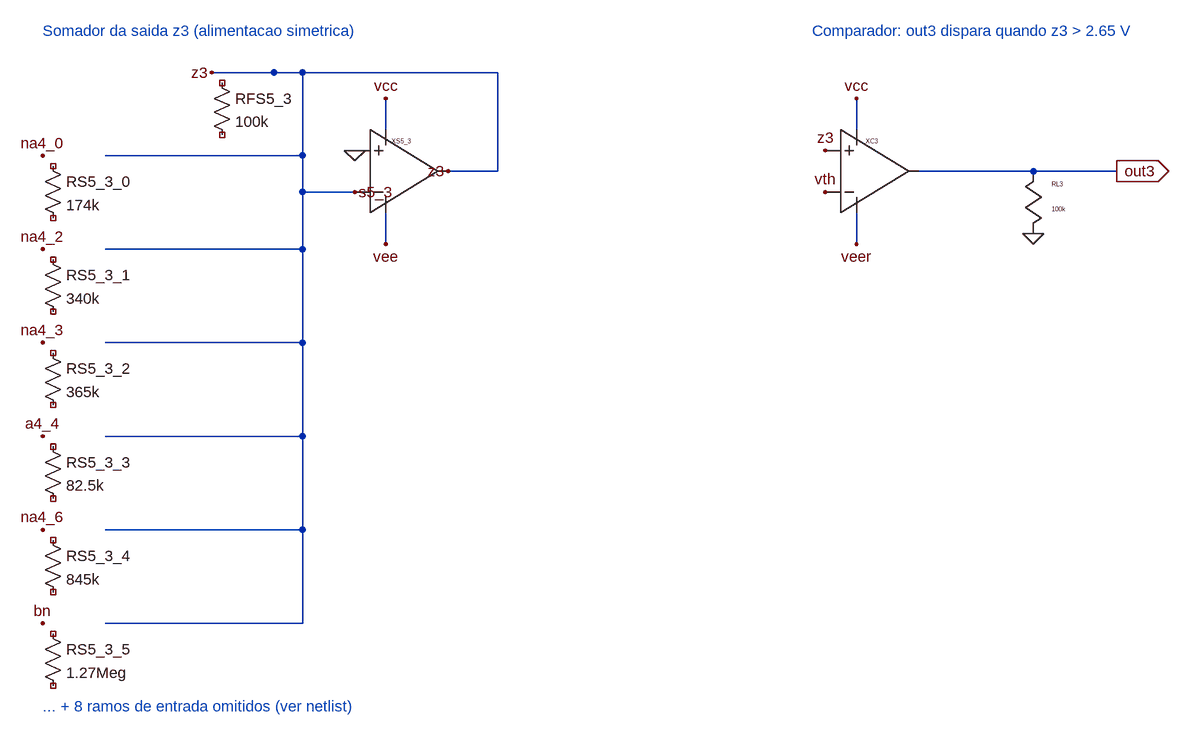
[diagram p0: schematic neuronio_saida.asc]
neuronio_saida.asc, the LTspice schematic file:
Version 4
SHEET 1 1976 1237
WIRE 624 184 624 136
WIRE 624 312 624 360
WIRE 452 96 496 96
WIRE 720 248 796 248
WIRE 796 248 796 96
WIRE 796 96 356 96
WIRE 192 224 496 224
WIRE 192 368 496 368
WIRE 192 512 496 512
WIRE 192 656 496 656
WIRE 192 800 496 800
WIRE 192 944 496 944
WIRE 496 96 496 944
WIRE 496 280 576 280
WIRE 1348 184 1348 136
WIRE 1348 312 1348 360
WIRE 1444 248 1620 248
WIRE 1620 248 1748 248
SYMBOL opamp2 576 184 R0
SYMATTR InstName XS5_3
SYMATTR Value CLAW_IDEAL_OPAMP
SYMBOL res 356 96 R0
SYMATTR InstName RFS5_3
SYMATTR Value 100k
SYMBOL res 96 224 R0
SYMATTR InstName RS5_3_0
SYMATTR Value 174k
SYMBOL res 96 368 R0
SYMATTR InstName RS5_3_1
SYMATTR Value 340k
SYMBOL res 96 512 R0
SYMATTR InstName RS5_3_2
SYMATTR Value 365k
SYMBOL res 96 656 R0
SYMATTR InstName RS5_3_3
SYMATTR Value 82.5k
SYMBOL res 96 800 R0
SYMATTR InstName RS5_3_4
SYMATTR Value 845k
SYMBOL res 96 944 R0
SYMATTR InstName RS5_3_5
SYMATTR Value 1.27Meg
SYMBOL opamp2 1300 184 R0
SYMATTR InstName XC3
SYMATTR Value CLAW_IDEAL_OPAMP
SYMBOL res_v 1620 248 R0
SYMATTR InstName RL3
SYMATTR Value 100k
FLAG 576 216 0
FLAG 624 136 vcc
FLAG 624 360 vee
FLAG 356 96 z3
FLAG 96 224 na4_0
FLAG 96 368 na4_2
FLAG 96 512 na4_3
FLAG 96 656 a4_4
FLAG 96 800 na4_6
FLAG 96 944 bn
FLAG 576 280 s5_3
FLAG 720 248 z3
FLAG 1300 216 z3
FLAG 1300 280 vth
FLAG 1348 136 vcc
FLAG 1348 360 veer
FLAG 1620 344 0
FLAG 1748 248 out3
IOPIN 1748 248 Out
TEXT 96 32 Left 2 ;Somador da saida z3 (alimentacao simetrica)
TEXT 1280 32 Left 2 ;Comparador: out3 dispara quando z3 > 2.65 V
TEXT 96 1072 Left 2 ;... + 8 ramos de entrada omitidos (ver netlist)

The netlist it stands for:
* neuronio_saida.asc
XXS5_3 CLAW_IDEAL_OPAMP CLAW_IDEAL_OPAMP
RFS5_3 NC_01 NC_02 100k
RS5_3_0 NC_03 NC_04 174k
RS5_3_1 NC_05 NC_06 340k
RS5_3_2 NC_07 NC_08 365k
RS5_3_3 NC_09 NC_10 82.5k
RS5_3_4 NC_11 NC_12 845k
RS5_3_5 NC_13 NC_14 1.27Meg
XXC3 CLAW_IDEAL_OPAMP CLAW_IDEAL_OPAMP
RL3 out3 0 100k
* Somador da saida z3 (alimentacao simetrica)
* Comparador: out3 dispara quando z3 > 2.65 V
* ... + 8 ramos de entrada omitidos (ver netlist)
.backanno
.end